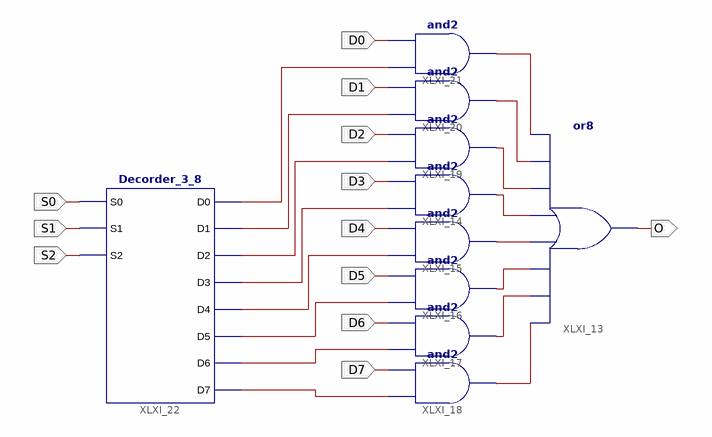
[diagram p0: schematic sheet 1]
// Xilinx ISE schematic Mux_8_1.sch (spartan3e) as structural Verilog: 10 symbols, 12 ports
module Mux_8_1 (
  input  D7,
  input  D6,
  input  D5,
  input  D4,
  input  D3,
  input  D2,
  input  D1,
  input  D0,
  input  S0,
  input  S1,
  input  S2,
  output O
);

  wire XLXN_74, XLXN_75, XLXN_76, XLXN_77, XLXN_78, XLXN_79, XLXN_80, XLXN_81, XLXN_130, XLXN_132, XLXN_133,
       XLXN_134, XLXN_135, XLXN_136, XLXN_137, XLXN_138;

  or XLXI_13 (O, XLXN_81, XLXN_80, XLXN_79, XLXN_78, XLXN_77, XLXN_76, XLXN_75, XLXN_74);
  and XLXI_21 (XLXN_74, XLXN_138, D0);
  and XLXI_20 (XLXN_75, XLXN_137, D1);
  and XLXI_19 (XLXN_76, XLXN_136, D2);
  and XLXI_18 (XLXN_81, XLXN_130, D7);
  and XLXI_17 (XLXN_80, XLXN_132, D6);
  and XLXI_16 (XLXN_79, XLXN_133, D5);
  and XLXI_15 (XLXN_78, XLXN_134, D4);
  and XLXI_14 (XLXN_77, XLXN_135, D3);
  Decorder_3_8 XLXI_22 (
    .D0(XLXN_138), .D1(XLXN_137), .D2(XLXN_136), .D3(XLXN_135), .D4(XLXN_134), .D5(XLXN_133), .D6(XLXN_132),
    .D7(XLXN_130), .S0(S0), .S1(S1), .S2(S2));
endmodule
